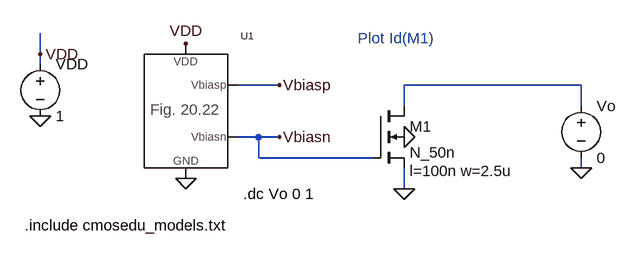
[diagram p0: schematic Fig20_28.asc]
Fig20_28.asc, the LTspice schematic file:
Version 4
SHEET 1 1288 680
WIRE 288 -16 288 -48
WIRE 288 0 288 -16
WIRE 656 32 592 32
WIRE 1120 32 848 32
WIRE 848 64 848 32
WIRE 1120 64 1120 32
WIRE 624 112 592 112
WIRE 656 112 624 112
WIRE 624 144 624 112
WIRE 800 144 624 144
WIRE 1120 160 1120 144
WIRE 848 192 848 160
FLAG 288 80 0
FLAG 288 -16 VDD
FLAG 512 -32 VDD
FLAG 512 176 0
FLAG 656 32 Vbiasp
FLAG 656 112 Vbiasn
FLAG 848 112 0
FLAG 848 192 0
FLAG 1120 160 0
SYMBOL voltage 288 -16 R0
WINDOW 123 0 0 Left 0
WINDOW 39 0 0 Left 0
SYMATTR InstName VDD
SYMATTR Value 1
SYMBOL nmos4 800 64 R0
WINDOW 123 56 100 Left 2
SYMATTR Value2 l=100n w=2.5u
SYMATTR InstName M1
SYMATTR Value N_50n
SYMBOL voltage 1120 48 R0
SYMATTR InstName Vo
SYMATTR Value 0
SYMBOL Fig_20_22 448 80 R0
SYMATTR InstName U1
TEXT 264 248 Left 2 !.include cmosedu_models.txt
TEXT 776 -40 Left 2 ;Plot Id(M1)
TEXT 600 200 Left 2 !.dc Vo 0 1

The netlist it stands for:
* Fig20_28.asc
VDD VDD 0 1
M1 N001 Vbiasn 0 0 N_50n l=100n w=2.5u
Vo N001 0 0
XU1 Vbiasn Vbiasp VDD 0 Fig_20_22  ; pins Vbiasn Vbiasp VDD GND
.model NMOS NMOS
.model PMOS PMOS
.lib standard.mos
.include cmosedu_models.txt
* Plot Id(M1)
.dc Vo 0 1
.backanno
.end